# EAGLE design LEDSlave (EAGLE 7.6.0)
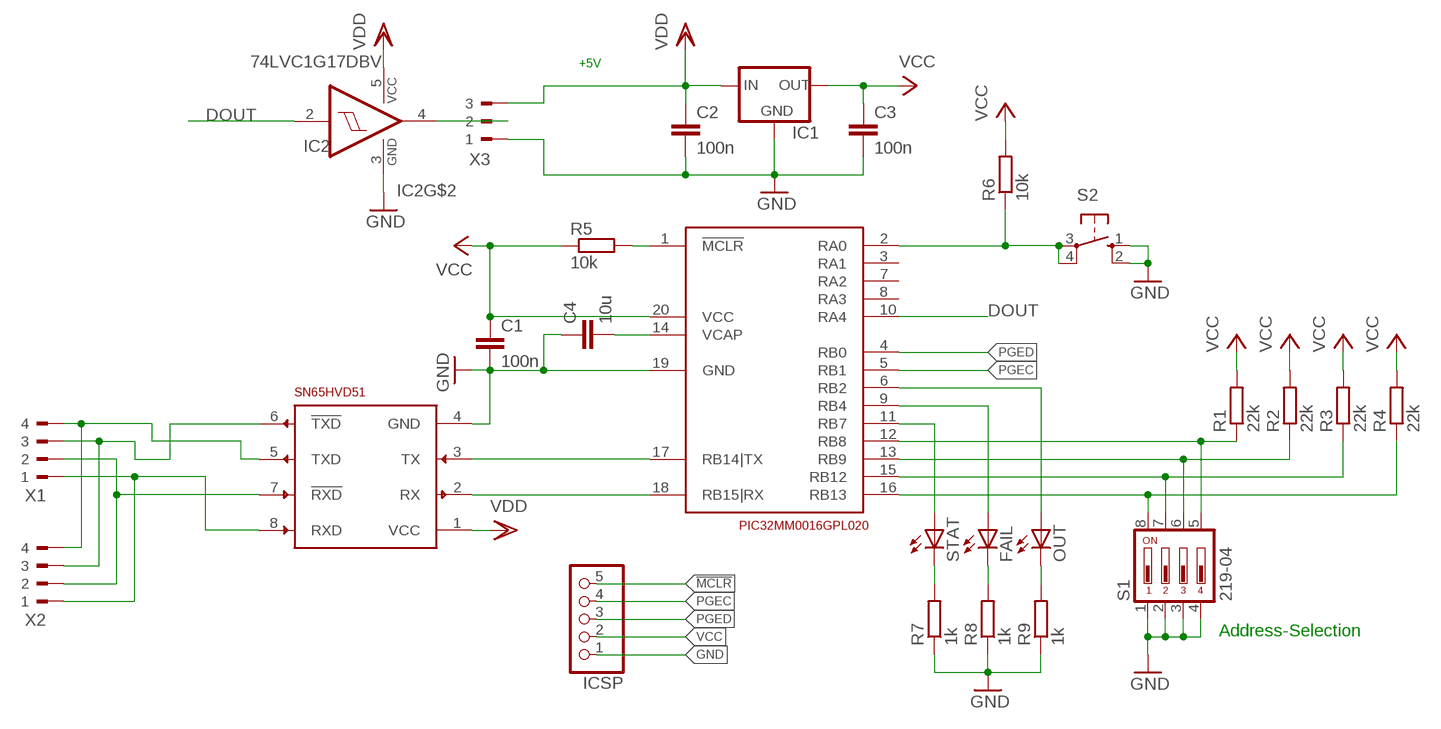
[diagram p0: schematic, sheet 1]

## Parts
C1  100n  C-EUC0805  [C0805]
C2  100n  C-EUC0805  [C0805]
C3  100n  C-EUC0805  [C0805]
C4  10u  C-EUC1206  [C1206]
FAIL  LED3MM  [LED3MM]
IC1  LP2950CZ-3.3  [TO92]
IC2  74LVC1G17DBV  [SOT23-5]
ICSP  PINHD-1X5  [1X05]
OUT  LED3MM  [LED3MM]
R1  22k  R-EU_R0805  [R0805]
R2  22k  R-EU_R0805  [R0805]
R3  22k  R-EU_R0805  [R0805]
R4  22k  R-EU_R0805  [R0805]
R5  10k  R-EU_R0805  [R0805]
R6  10k  R-EU_R0805  [R0805]
R7  1k  R-EU_R0805  [R0805]
R8  1k  R-EU_R0805  [R0805]
R9  1k  R-EU_R0805  [R0805]
S1  219-04  [CTS-219-04]
S2  10-XX  [B3F-10XX]
STAT  LED3MM  [LED3MM]
U$1  PIC32MM0016GPL020  [SSOP20]
U$2  SN65HVD51  [SO-08]
X1  90-4  [90-4]
X2  90-4  [90-4]
X3  90-3  [90-3]

## Nets
!MCLR: ICSP.5 R5.2 U$1.1(!MCLR)
DOUT: IC2.2(I) U$1.10(RA4)
GND: C1.2 C2.2 C3.2 C4.1 IC1.2(GND) IC2.3(GND) ICSP.1 R7.1 R8.1 R9.1 S1.1 S1.2 S1.3 S1.4 S2.1(S) S2.2(S1) U$1.19(GND) U$2.4(GND) X3.1
N$1: U$1.17(RB14|TX) U$2.3(TX)
N$2: U$1.18(RB15|RX) U$2.2(RX)
N$3: R4.1 S1.8 U$1.16(RB13)
N$4: R3.1 S1.7 U$1.15(RB12)
N$5: R2.1 S1.6 U$1.13(RB9)
N$6: R1.1 S1.5 U$1.12(RB8)
N$7: STAT.A U$1.11(RB7)
N$8: IC2.4(O) X3.2
N$9: R6.1 S2.3(P) S2.4(P1) U$1.2(RA0)
N$10: FAIL.A U$1.9(RB4)
N$11: C4.2 U$1.14(VCAP)
N$13: U$2.7(!RXD) X1.2 X2.2
N$14: U$2.6(!TXD) X1.3 X2.3
N$16: OUT.A U$1.6(RB2)
N$17: R7.2 STAT.K(C)
N$18: FAIL.K(C) R8.2
N$19: OUT.K(C) R9.2
N$20: U$2.8(RXD) X1.1 X2.1
N$22: U$2.5(TXD) X1.4 X2.4
PGEC: ICSP.4 U$1.5(RB1)
PGED: ICSP.3 U$1.4(RB0)
VCC: C1.1 C3.1 IC1.1(OUT) ICSP.2 R1.2 R2.2 R3.2 R4.2 R5.1 R6.2 U$1.20(VCC)
VDD: C2.1 IC1.3(IN) IC2.5(VCC) U$2.1(VCC) X3.3
Unconnected: U$1.3(RA1) U$1.7(RA2) U$1.8(RA3)

## Notes on the sheet
- +5V
- Address-Selection

## Library data of the parts
C1-C4 = rcl:C-EU: CAPACITOR, European symbol
FAIL OUT STAT = led:LED: LED OSRAM: - CHIPLED LG R971, LG N971, LY N971, LG Q971, LY Q971, LO R971, LY R971 LH N974, LH R974 LS Q976, LO Q976, LY Q976 LO Q996 - Hyper CHIPLED LW Q18S LB Q993, LB Q99A, LB R99A - SideLED LS A670, LO A670, LY A670, LG A670, LP A670 LB A673, LV A673, LT A673, LW A673 LH A674 LY A675 LS A676, LA A676, LO A676, LY A676, LW A676 LS A679, LY A679, LG A679 - Hyper Micro SIDELED® LS Y876, LA Y876, LO Y876, LY Y876 LT Y87S - SmartLED LW L88C, LW L88S LB L89C, LB L89S, LG L890 LS L89K, LO L89K, LY L89K LS L896, LA L896, LO L896, LY L896 - TOPLED LS T670, LO T670, LY T670, LG T670, LP T670 LSG T670, LSP T670, LSY T670, LOP T670, LYG T670 LG T671, LOG T671, LSG T671 LB T673, LV T673, LT T673, LW T673 LH T674 LS T676, LA T676, LO T676, LY T676, LB T676, LH T676, LSB T676, LW T676 LB T67C, LV T67C, LT T67C, LS T67K, LO T67K, LY T67K, LW E67C LS E67B, LA E67B, LO E67B, LY E67B, LB E67C, LV E67C, LT E67C LW T67C LS T679, LY T679, LG T679 LS T770, LO T770, LY T770, LG T770, LP T770 LB T773, LV T773, LT T773, LW T773 LH T774 LS E675, LA E675, LY E675, LS T675 LS T776, LA T776, LO T776, LY T776, LB T776 LHGB T686 LT T68C, LB T68C - Hyper Mini TOPLED® LB M676 - Mini TOPLED Santana® LG M470 LS M47K, LO M47K, LY M47K Source: http://www.osram.convergy.de LUXEON: - LUMILED® LXK2-PW12-R00, LXK2-PW12-S00, LXK2-PW14-U00, LXK2-PW14-V00 LXK2-PM12-R00, LXK2-PM12-S00, LXK2-PM14-U00 LXK2-PE12-Q00, LXK2-PE12-R00, LXK2-PE12-S00, LXK2-PE14-T00, LXK2-PE14-U00 LXK2-PB12-K00, LXK2-PB12-L00, LXK2-PB12-M00, LXK2-PB14-N00, LXK2-PB14-P00, LXK2-PB14-Q00 LXK2-PR12-L00, LXK2-PR12-M00, LXK2-PR14-Q00, LXK2-PR14-R00 LXK2-PD12-Q00, LXK2-PD12-R00, LXK2-PD12-S00 LXK2-PH12-R00, LXK2-PH12-S00 LXK2-PL12-P00, LXK2-PL12-Q00, LXK2-PL12-R00 Source: www.luxeon.com KINGBRIGHT: KA-3528ASYC Source: www.kingbright.com
IC1 = v-reg:LP2950?*: Source: http://cache.national.com/ds/LP/LP2950.pdf
IC2 = 74xx-little-us:74*1G17: Single Schmitt-Trigger Buffer
ICSP = pinhead:PINHD-1X5: PIN HEADER
R1-R9 = rcl:R-EU_: RESISTOR, European symbol
S1 = switch-dil:219-04*: Surface Mount DIP Switch Series 219 SMT CTS Electronic Components Sourc: www.ctscorp.com; OC_FARNELL: unknown; OC_NEWARK: unknown
S2 = switch-omron:10-XX: OMRON SWITCH; MPN: B3F-1000; OC_FARNELL: 176432; OC_NEWARK: 36M3542
U$1 = PIC32MM0016GPL020:PIC32MM0016GPL020
U$2 = SN65HVD51 1:SN65HVD51
X1 X2 = con-weidmueller-sl35:90-4: WEIDMUELLER CLAMP CONNECTOR; OC_FARNELL: unknown; OC_NEWARK: unknown
X3 = con-weidmueller-sl35:90-3: WEIDMUELLER CLAMP CONNECTOR; OC_FARNELL: unknown; OC_NEWARK: unknown

## Board
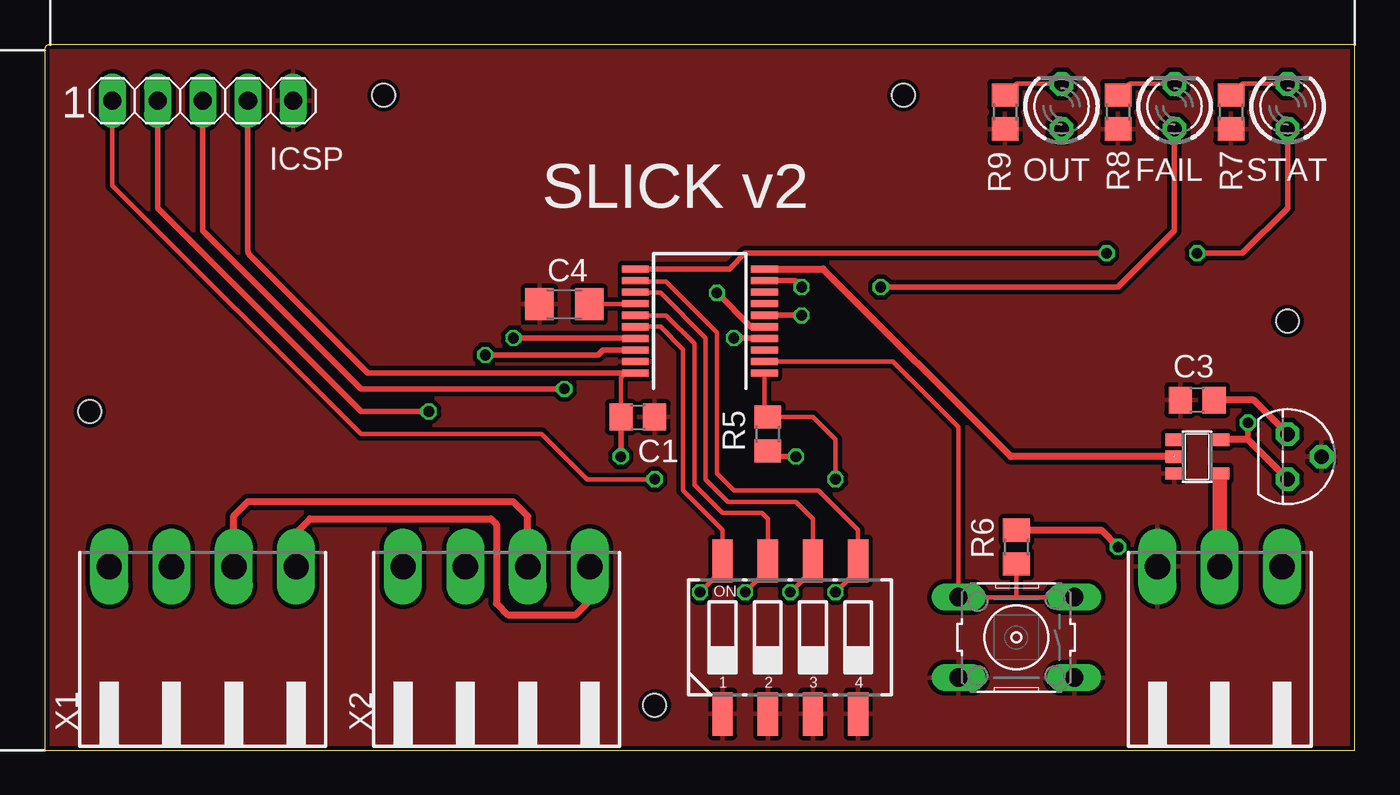
[diagram p1: board, top side]
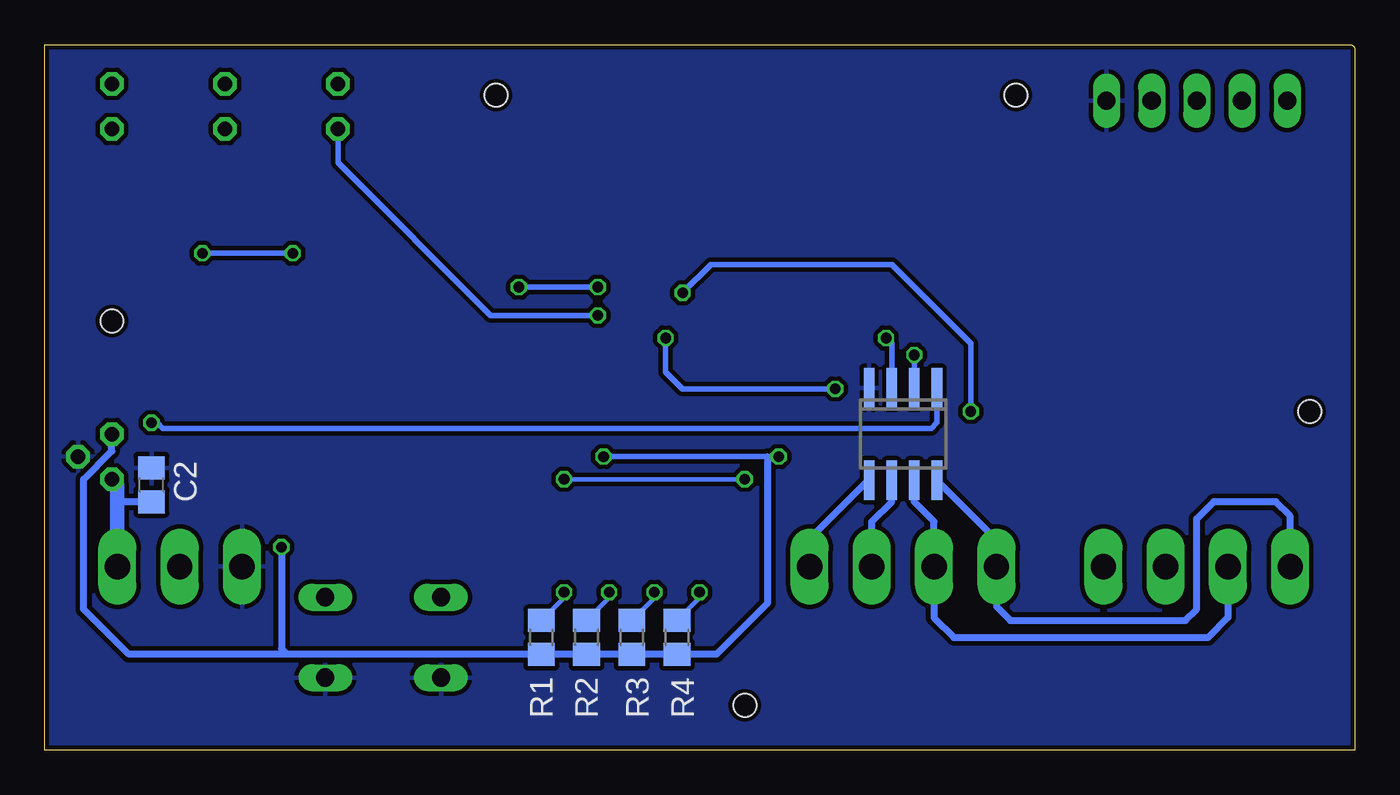
[diagram p2: board, bottom side, seen from below]

Size 73.64 x 39.67 mm. Coordinates in mm from the lower left corner, seen from the top.
Outline: 0,0 73.64,0 73.64,39.67 0.32,39.67 arc90 0,39.36 0,0
Copper layers (1*16): Top 0.035mm / dielectric 1.5mm / Bottom 0.035mm
Design rules "dirty_cheap": minimum track width 5mil, minimum drill 12mil, track to track 5mil, track to pad 5mil, pad to pad 5mil, via to via 5mil, smd to smd 0mil, copper to edge 10mil, drill to drill 10mil, minimum pad ring 10mil, minimum via ring 6mil, stop-mask expansion 2mil, vias tented up to drill 25mil, thermal gap 10mil
Holes 1.3 mm at 19.05,36.83 69.85,24.13 48.26,36.83 2.54,19.05 34.29,2.54

### Footprints (pad centres in the part's own frame; a part is rotated, then mirrored left to right if it is on the bottom)
C0805 = smd 1.3 x 1.5: 1 -0.95,0; 2 0.95,0
C1206 = smd 1.6 x 1.8: 1 -1.4,0; 2 1.4,0
LED3MM = drill 0.813 octagon: A -1.27,0; K 1.27,0
TO92 = drill 0.813 octagon: 1 -1.27,0; 2 0,1.905; 3 1.27,0
SOT23-5 = smd 0.69 x 0.99: 1 -0.95,-1.29; 2 0,-1.29; 3 0.95,-1.29; 4 0.95,1.3; 5 -0.95,1.3
1X05 = drill 1.016 long: 1 -5.08,0; 2 -2.54,0; 3 0,0; 4 2.54,0; 5 5.08,0
R0805 = smd 1.3 x 1.5: 1 -0.95,0; 2 0.95,0
CTS-219-04 = smd 1.13 x 2.44: 1 -3.81,-4.3; 2 -1.27,-4.3; 3 1.27,-4.3; 4 3.81,-4.3; 5 3.81,4.3; 6 1.27,4.3; 7 -1.27,4.3; 8 -3.81,4.3
B3F-10XX = drill 1.016 long: 1 -3.251,2.261; 2 3.251,2.261; 3 -3.251,-2.261; 4 3.251,-2.261
SSOP20 = smd 0.4 x 1.5: 1 -2.925,-3.625; 2 -2.275,-3.625; 3 -1.625,-3.625; 4 -0.975,-3.625; 5 -0.325,-3.625; 6 0.325,-3.625; 7 0.975,-3.625; 8 1.625,-3.625; 9 2.275,-3.625; 10 2.925,-3.625; 11 2.925,3.625; 12 2.275,3.625; 13 1.625,3.625; 14 0.975,3.625; 15 0.325,3.625; 16 -0.325,3.625; 17 -0.975,3.625; 18 -1.625,3.625; 19 -2.275,3.625; 20 -2.925,3.625
SO-08 = smd 0.6 x 2.2: 1 -1.905,-2.6; 2 -0.635,-2.6; 3 0.635,-2.6; 4 1.905,-2.6; 5 1.905,2.6; 6 0.635,2.6; 7 -0.635,2.6; 8 -1.905,2.6
90-4 = drill 1.422 long: 1 -5.25,5.25; 2 -1.75,5.25; 3 1.75,5.25; 4 5.25,5.25
90-3 = drill 1.422 long: 1 -3.5,5.25; 2 0,5.25; 3 3.5,5.25

### Placement (x,y rotation side)
C1  33.34,18.73 0 top
C2  67.63,14.92 90 bottom
C3  64.77,19.68 180 top
C4  29.21,25.08 0 top
FAIL  63.5,36.2 90 top
IC1  69.85,16.51 270 top
IC2  64.77,16.51 270 top
ICSP  8.89,36.51 180 top
OUT  57.15,36.2 90 top
R1  45.72,6.35 270 bottom
R2  43.18,6.35 270 bottom
R3  40.64,6.35 270 bottom
R4  38.1,6.35 270 bottom
R5  40.64,17.78 90 top
R6  54.61,11.43 90 top
R7  66.67,35.88 90 top
R8  60.33,35.88 90 top
R9  53.98,35.88 90 top
S1  41.91,6.35 0 top
S2  54.61,6.35 180 top
STAT  69.85,36.2 90 top
U$1  36.83,24.13 90 top
U$2  25.4,17.78 180 bottom
X1  8.89,5.08 0 top
X2  25.4,5.08 0 top
X3  66.04,5.08 0 top

### Tracks (layer width: path | path; a pad name or v marks a point on that pad's centre or on a via)
!MCLR  (via drill 0.6)
  Top 0.254: U$1.1 40.45,18.91 R5.2 43.18,18.73 44.45,17.46 v44.45,15.24 | ICSP.5 3.81,31.75 17.78,17.78 27.94,17.78 30.48,15.24 v34.29,15.24
  Bottom 0.254: v34.29,15.24 v44.45,15.24
DOUT
  Top 0.406: IC2.2 54.29,16.51 43.75,27.05 U$1.10
GND
  pour Bottom (isolate 0.254): 0,40.64 73.66,40.64 73.66,0 0,0
  pour Top (isolate 0.254): 0,40.64 73.66,40.64 73.66,0 0,0
N$1  (via drill 0.6)
  Top 0.305: v26.35,23.18 33.18,23.18 U$1.17
  Bottom 0.305: U$2.3 26.04,22.86 v26.35,23.18
N$2  (via drill 0.6)
  Top 0.305: v24.77,22.23 31.11,22.23 31.39,22.5 U$1.18
  Bottom 0.305: U$2.2 v24.77,22.23
N$3  (via drill 0.6)
  Top 0.254: U$1.16 33.21,23.81 34.61,23.81 35.88,22.54 35.88,14.61 38.1,12.38 S1.8 38.1,10.16 v36.83,8.89
  Bottom 0.254: v36.83,8.89 36.83,8.57 R4.1
N$4  (via drill 0.6)
  Top 0.254: U$1.15 33.21,24.45 34.92,24.45 36.51,22.86 36.51,14.92 38.1,13.34 40.32,13.34 40.64,13.02 S1.7 40.64,10.16 v39.37,8.89
  Bottom 0.254: v39.37,8.89 39.37,8.57 R3.1
N$5  (via drill 0.6)
  Top 0.254: U$1.13 33.24,25.72 34.61,25.72 37.15,23.18 37.15,15.24 38.42,13.97 42.23,13.97 43.18,13.02 S1.6 43.18,10.16 v41.91,8.89
  Bottom 0.254: v41.91,8.89 41.91,8.57 R2.1
N$6  (via drill 0.6)
  Top 0.254: U$1.12 33.26,26.35 34.92,26.35 37.78,23.5 37.78,15.56 38.73,14.61 43.5,14.61 45.72,12.38 S1.5 45.72,10.16 v44.45,8.89
  Bottom 0.254: v44.45,8.89 44.45,8.57 R1.1
N$7  (via drill 0.6)
  Top 0.305: U$1.11 38.48,27.05 39.37,27.94 v59.69,27.94 | v64.77,27.94 67.31,27.94 69.85,30.48 STAT.A
  Bottom 0.305: v59.69,27.94 v64.77,27.94
N$8
  Top 0.406: 66.04,15.24 66.04,15.53 IC2.4
  Top 0.813: X3.2 66.04,15.24
N$9
  Top 0.254: S2.3 54.61,8.61 | 54.61,8.61 S2.4 51.36,18.17 47.68,21.86 U$1.2 | R6.1 54.61,8.61
N$10  (via drill 0.6)
  Top 0.305: U$1.9 42.17,26.41 v42.55,26.04 | v46.99,26.04 60.33,26.04 63.5,29.21 FAIL.A
  Bottom 0.305: v42.55,26.04 v46.99,26.04
N$11
  Top 0.254: C4.2 33.18,25.08 U$1.14
N$13
  Bottom 0.406: U$2.7 24.77,13.97 23.65,12.86 X2.2 23.65,7.46 22.54,6.35 8.26,6.35 7.14,7.46 X1.2
N$14
  Top 0.406: X1.3 10.64,13.18 11.43,13.97 26.35,13.97 27.15,13.17 X2.3
  Bottom 0.406: X2.3 27.15,12.86 26.04,13.97 U$2.6
N$16  (via drill 0.6)
  Top 0.305: U$1.6 42.54,24.46 v42.55,24.45
  Bottom 0.305: v42.55,24.45 48.58,24.45 57.15,33.02 OUT.A
N$17
  Top 0.254: R7.2 67.31,37.46 STAT.K
N$18
  Top 0.254: R8.2 60.96,37.46 FAIL.K
N$19
  Top 0.254: R9.2 54.61,37.46 OUT.K
N$20
  Bottom 0.406: U$2.8 20.15,11.84 X2.1 20.15,8.09 19.37,7.3 9.53,7.3 8.89,7.94 8.89,13.02 7.94,13.97 4.45,13.97 3.64,13.17 X1.1
N$22
  Top 0.406: X1.4 14.14,12.24 14.92,13.02 25.08,13.02 25.4,12.7 25.4,8.26 26.04,7.62 29.84,7.62 30.65,8.43 X2.4
  Bottom 0.406: U$2.5 27.36,15.18 30.65,11.89 X2.4
PGEC  (via drill 0.6)
  Top 0.305: ICSP.4 6.35,30.48 17.78,19.05 v21.59,19.05 | U$1.5 39.7,23.8 v37.78,25.72
  Bottom 0.305: v21.59,19.05 21.59,22.86 26.04,27.3 36.2,27.3 v37.78,25.72
PGED  (via drill 0.6)
  Top 0.305: ICSP.3 8.89,29.21 17.78,20.32 v29.21,20.32 | v38.73,23.18 40.43,23.18 U$1.4
  Bottom 0.305: v29.21,20.32 37.78,20.32 38.73,21.27 v38.73,23.18
VCC  (via drill 0.6)
  Top 0.254: U$1.20 32.63,21.21 32.38,20.96 C1.1
  Top 0.305: ICSP.2 11.43,28.07 arc45 11.52,27.85 18.16,21.21 32.63,21.21 | C1.1 v32.39,16.51 v32.38,16.51 | v42.23,16.51 40.96,16.51 R5.1
  Top 0.406: IC1.1 67.94,19.68 C3.1 | R6.2 59.38,12.38 v60.33,11.43
  Bottom 0.305: v32.38,16.51 33.02,16.51 v42.23,16.51
  Bottom 0.406: 60.01,5.4 R1.2 R2.2 R3.2 R4.2 35.88,5.4 33.02,8.26 33.02,16.51 | 60.01,5.4 68.9,5.4 71.44,7.94 71.44,15.24 69.85,16.83 IC1.1 | v60.33,11.43 60.33,5.72 60.01,5.4
VDD  (via drill 0.6)
  Top 0.305: 67.63,17.46 v67.63,18.41
  Top 0.406: IC1.3 67.63,17.46 IC2.5
  Bottom 0.305: U$2.1 23.5,18.41 23.81,18.1 66.99,18.1 67.31,18.41 v67.63,18.41
  Bottom 0.406: C2.1 69.54,13.97
  Bottom 0.813: X3.3 69.54,13.97 69.54,14.93 IC1.3

### Text on the board
tPlace: 1 | SLICK v2